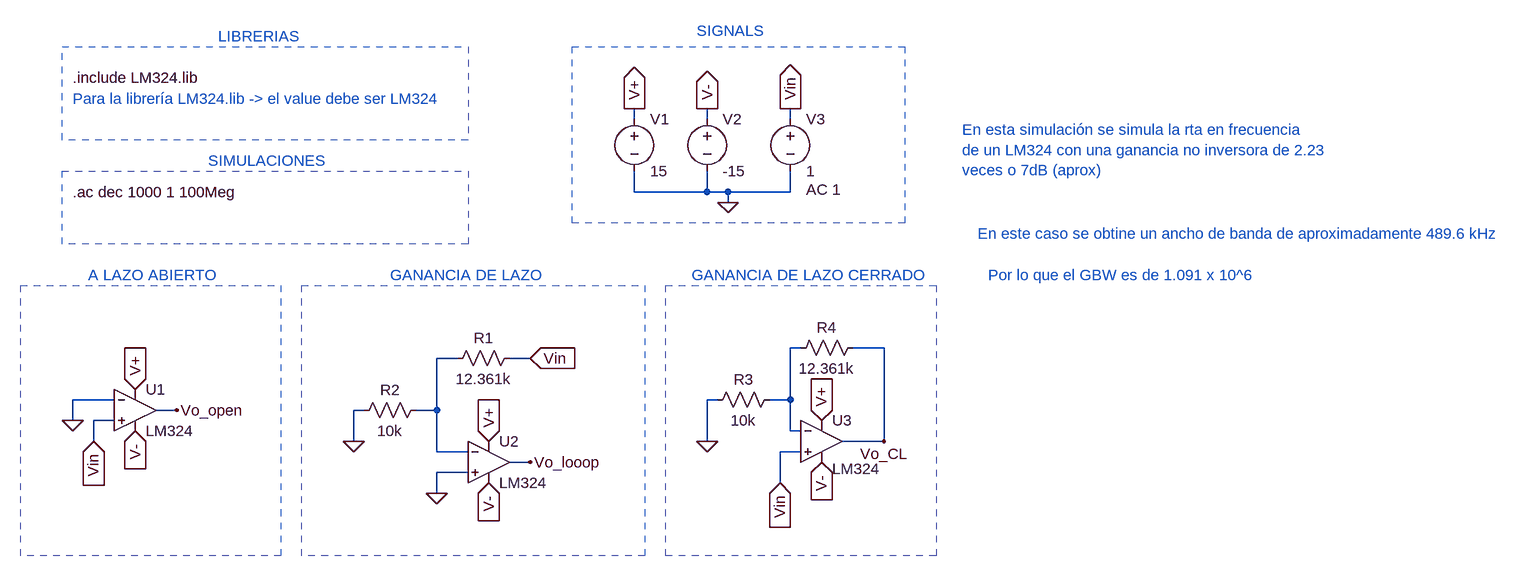
[diagram p0: schematic LM324_NI_single_AO2.asc]
LM324_NI_single_AO2.asc, the LTspice schematic file:
Version 4.1
SHEET 1 1948 680
WIRE 560 -224 560 -240
WIRE 672 -224 672 -240
WIRE 800 -224 800 -240
WIRE 560 -112 560 -144
WIRE 672 -112 672 -144
WIRE 672 -112 560 -112
WIRE 704 -112 672 -112
WIRE 800 -112 800 -144
WIRE 800 -112 704 -112
WIRE 704 -96 704 -112
WIRE 816 128 800 128
WIRE 944 128 896 128
WIRE 288 144 256 144
WIRE 400 144 368 144
WIRE -240 208 -304 208
WIRE 688 208 672 208
WIRE 800 208 800 128
WIRE 800 208 768 208
WIRE -144 224 -176 224
WIRE 144 224 128 224
WIRE 256 224 256 144
WIRE 256 224 224 224
WIRE -304 240 -304 208
WIRE -240 240 -272 240
WIRE 800 256 800 208
WIRE 816 256 800 256
WIRE -272 272 -272 240
WIRE 128 272 128 224
WIRE 672 272 672 208
WIRE 944 272 944 128
WIRE 944 272 880 272
WIRE 256 288 256 224
WIRE 304 288 256 288
WIRE 816 288 784 288
WIRE 400 304 368 304
WIRE 304 320 256 320
WIRE 784 336 784 288
WIRE 256 352 256 320
FLAG 704 -96 0
FLAG 560 -240 V+
IOPIN 560 -240 Out
FLAG 672 -240 V-
IOPIN 672 -240 Out
FLAG 800 -240 Vin
IOPIN 800 -240 Out
FLAG -304 240 0
FLAG -208 192 V+
IOPIN -208 192 In
FLAG 336 272 V+
IOPIN 336 272 In
FLAG 848 240 V+
IOPIN 848 240 In
FLAG -208 256 V-
IOPIN -208 256 In
FLAG 336 336 V-
IOPIN 336 336 In
FLAG 848 304 V-
IOPIN 848 304 In
FLAG 256 352 0
FLAG 128 272 0
FLAG 400 144 Vin
IOPIN 400 144 In
FLAG -272 272 Vin
IOPIN -272 272 In
FLAG 784 336 Vin
IOPIN 784 336 In
FLAG -144 224 Vo_open
FLAG 400 304 Vo_looop
FLAG 672 272 0
FLAG 944 272 Vo_CL
SYMBOL OpAmps\\opamp2 -208 160 R0
SYMATTR InstName U1
SYMATTR Value LM324
SYMBOL voltage 560 -240 R0
SYMATTR InstName V1
SYMATTR Value 15
SYMBOL voltage 672 -240 R0
SYMATTR InstName V2
SYMATTR Value -15
SYMBOL voltage 800 -240 R0
WINDOW 123 24 124 Left 2
WINDOW 39 0 0 Left 0
SYMATTR Value2 AC 1
SYMATTR InstName V3
SYMATTR Value 1
SYMBOL OpAmps\\opamp2 336 240 R0
SYMATTR InstName U2
SYMATTR Value LM324
SYMBOL OpAmps\\opamp2 848 208 R0
WINDOW 3 16 106 Left 2
SYMATTR Value LM324
SYMATTR InstName U3
SYMBOL res 384 128 R90
WINDOW 0 0 56 VBottom 2
WINDOW 3 32 56 VTop 2
SYMATTR InstName R1
SYMATTR Value 12.361k
SYMBOL res 240 208 R90
WINDOW 0 0 56 VBottom 2
WINDOW 3 32 56 VTop 2
SYMATTR InstName R2
SYMATTR Value 10k
SYMBOL res 784 192 R90
WINDOW 0 0 56 VBottom 2
WINDOW 3 32 56 VTop 2
SYMATTR InstName R3
SYMATTR Value 10k
SYMBOL res 912 112 R90
WINDOW 0 0 56 VBottom 2
WINDOW 3 32 56 VTop 2
SYMATTR InstName R4
SYMATTR Value 12.361k
TEXT -304 -288 Left 2 !.include LM324.lib
TEXT -304 -256 Left 2 ;Para la librería LM324.lib -> el value debe ser LM324
TEXT -80 -352 Left 2 ;LIBRERIAS
TEXT 656 -360 Left 2 ;SIGNALS
TEXT -280 16 Left 2 ;A LAZO ABIERTO
TEXT 184 16 Left 2 ;GANANCIA DE LAZO
TEXT 648 16 Left 2 ;GANANCIA DE LAZO CERRADO
TEXT -304 -112 Left 2 !.ac dec 1000 1 100Meg
TEXT -96 -160 Left 2 ;SIMULACIONES
TEXT 1064 -208 Left 2 ;En esta simulación se simula la rta en frecuencia\nde un LM324 con una ganancia no inversora de 2.23 \nveces o 7dB (aprox)
TEXT 1088 -48 Left 2 ;En este caso se obtine un ancho de banda de aproximadamente 489.6 kHz
TEXT 1104 16 Left 2 ;Por lo que el GBW es de 1.091 x 10^6
RECTANGLE Normal 304 -192 -320 -336 2
RECTANGLE Normal 976 -64 464 -336 2
RECTANGLE Normal 16 448 -384 32 2
RECTANGLE Normal 576 448 48 32 2
RECTANGLE Normal 1024 448 608 32 2
RECTANGLE Normal 304 -32 -320 -144 2

The netlist it stands for:
* LM324_NI_single_AO2.asc
X§U1 Vin 0 V+ V- Vo_open LM324  ; pins In+ In- V+ V- OUT
V1 V+ 0 15
V2 V- 0 -15
V3 Vin 0 1 AC 1
X§U2 0 N002 V+ V- Vo_looop LM324  ; pins In+ In- V+ V- OUT
X§U3 Vin N001 V+ V- Vo_CL LM324  ; pins In+ In- V+ V- OUT
R1 Vin N002 12.361k
R2 N002 0 10k
R3 N001 0 10k
R4 Vo_CL N001 12.361k
.include LM324.lib
* Para la librería LM324.lib -> el value debe ser LM324
* LIBRERIAS
* SIGNALS
* A LAZO ABIERTO
* GANANCIA DE LAZO
* GANANCIA DE LAZO CERRADO
.ac dec 1000 1 100Meg
* SIMULACIONES
* En esta simulación se simula la rta en frecuencia
* de un LM324 con una ganancia no inversora de 2.23
* veces o 7dB (aprox)
* En este caso se obtine un ancho de banda de aproximadamente 489.6 kHz
* Por lo que el GBW es de 1.091 x 10^6
.backanno
.end